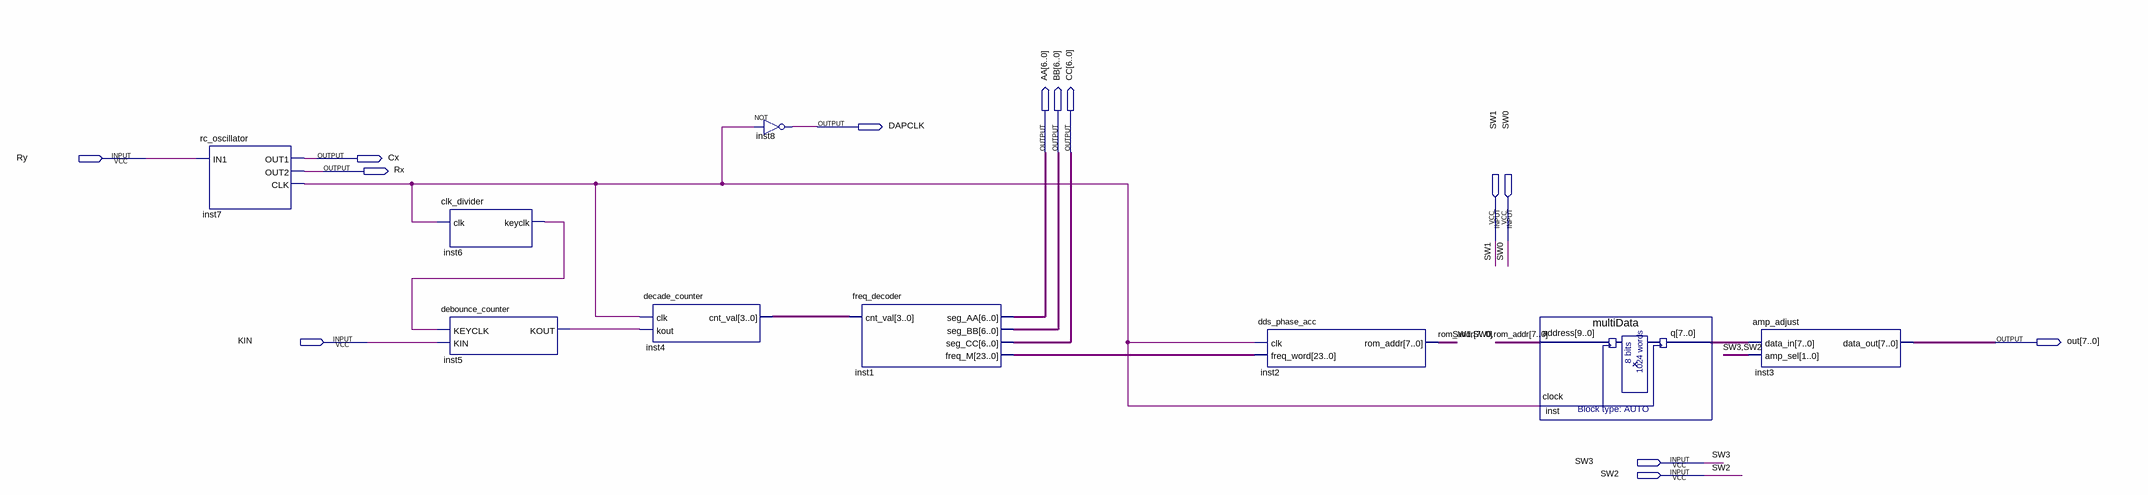
[diagram p0: schematic sheet]
// Quartus schematic final.bdf as structural Verilog: 9 symbols, 13 pins
module \final  (
  input  Ry,
  input  SW1,
  input  SW0,
  input  KIN,
  input  SW3,
  input  SW2,
  output DAPCLK,
  output [6:0] AA,
  output [6:0] BB,
  output [6:0] CC,
  output Cx,
  output Rx,
  output [7:0] out
);

  wire inst5_kout, inst6_keyclk, inst7_clk;
  wire [3:0] inst4_cnt_val;
  wire [7:0] inst_q, rom_addr;
  wire [23:0] inst1_freq_m;

  rc_oscillator inst7 (.IN1(Ry), .OUT1(Cx), .OUT2(Rx), .CLK(inst7_clk));
  clk_divider inst6 (.clk(inst7_clk), .keyclk(inst6_keyclk));
  debounce_counter inst5 (.KEYCLK(inst6_keyclk), .KIN(KIN), .KOUT(inst5_kout));
  decade_counter inst4 (.clk(inst7_clk), .kout(inst5_kout), .cnt_val(inst4_cnt_val));
  not inst8 (DAPCLK, inst7_clk);
  freq_decoder inst1 (.cnt_val(inst4_cnt_val), .seg_AA(AA), .seg_BB(BB), .seg_CC(CC), .freq_M(inst1_freq_m));
  dds_phase_acc inst2 (.clk(inst7_clk), .freq_word(inst1_freq_m), .rom_addr(rom_addr));
  multiData inst (.address({SW1, SW0, rom_addr}), .clock(inst7_clk), .q(inst_q));
  amp_adjust inst3 (.data_in(inst_q), .amp_sel({SW3, SW2}), .data_out(out));
endmodule
